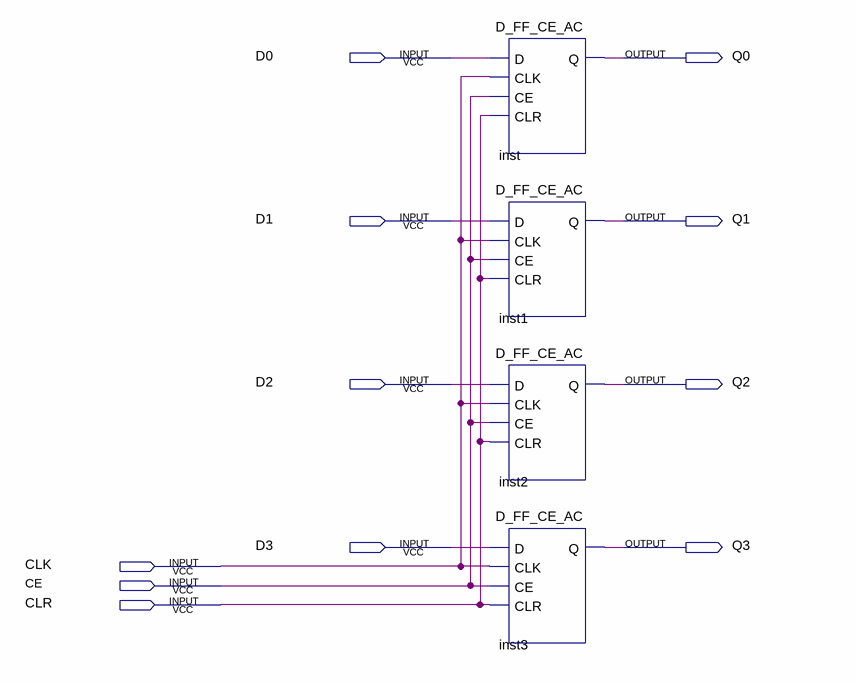
[diagram p0: schematic sheet]
// Quartus schematic register_4.bdf as structural Verilog: 4 symbols, 11 pins
module register_4 (
  input  D0,
  input  D1,
  input  D2,
  input  D3,
  input  CLK,
  input  CE,
  input  CLR,
  output Q0,
  output Q1,
  output Q2,
  output Q3
);

  D_FF_CE_AC inst (.D(D0), .CLK(CLK), .CE(CE), .CLR(CLR), .Q(Q0));
  D_FF_CE_AC inst1 (.D(D1), .CLK(CLK), .CE(CE), .CLR(CLR), .Q(Q1));
  D_FF_CE_AC inst2 (.D(D2), .CLK(CLK), .CE(CE), .CLR(CLR), .Q(Q2));
  D_FF_CE_AC inst3 (.D(D3), .CLK(CLK), .CE(CE), .CLR(CLR), .Q(Q3));
endmodule
